# Altium schematic sheet PSU.SchDoc
size B
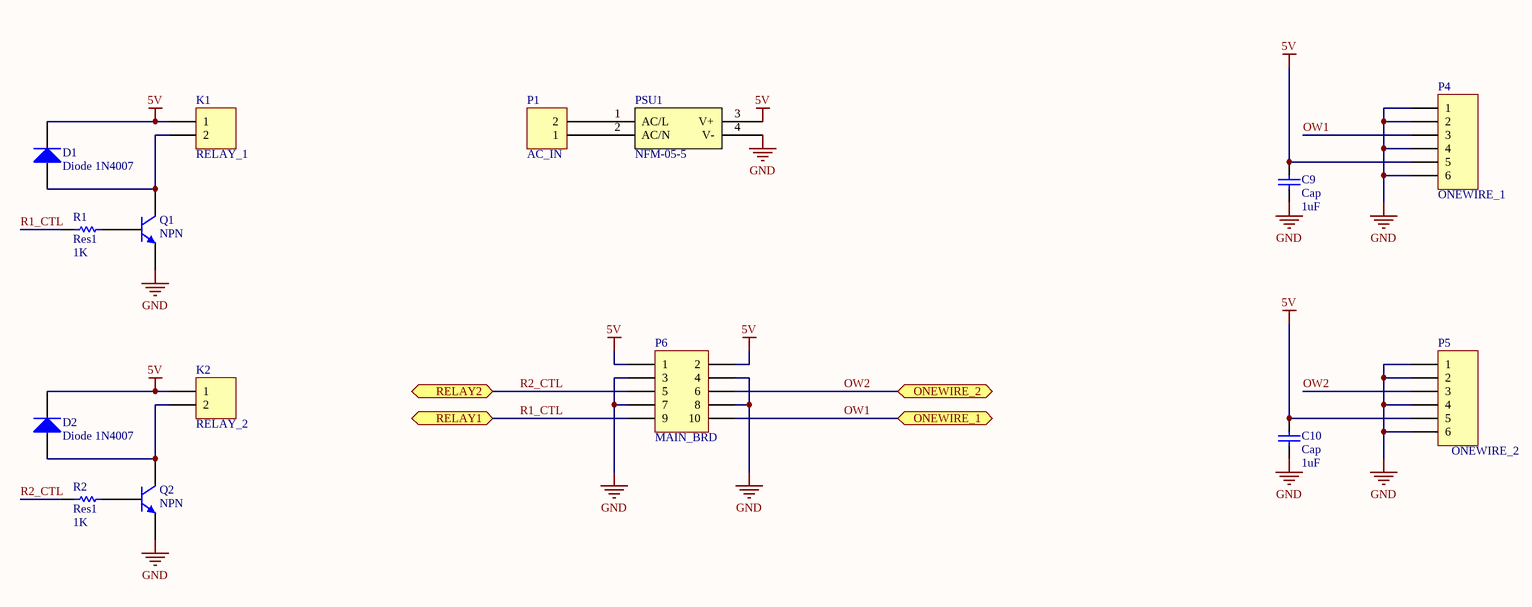
[diagram p0: PSU.SchDoc]

## Parts
C9  Cap  value 1uF  [RAD-0.2]
C10  Cap  value 1uF  [RAD-0.2]
D1  Diode 1N4007  [DO-41]
D2  Diode 1N4007  [DO-41]
K1  RELAY_1  [ALE12XXX]
K2  RELAY_2  [ALE12XXX]
P1  AC_IN  [2POS 0.312" HEADER]
P4  ONEWIRE_1  [CONN MOD JACK R/A 6P6C]
P5  ONEWIRE_2  [CONN MOD JACK R/A 6P6C]
P6  MAIN_BRD  [HDR2X5]
PSU1  NFM-05-5  [NFM-05-5]
Q1  NPN  [TO-92 BENT LEAD]
Q2  NPN  [TO-92 BENT LEAD]
R1  Res1  value 1K  [AXIAL-0.3]
R2  Res1  value 1K  [AXIAL-0.3]

## Ports
ONEWIRE_1, ONEWIRE_2, RELAY1, RELAY2

## Nets
5V: C9.2 C10.2 D1.2(K) D2.2(K) K1.1 K2.1 P4.5 P5.5 P6.1 P6.2 PSU1.3(V+)
GND: C9.1 C10.1 P4.1 P4.2 P4.4 P4.6 P5.1 P5.2 P5.4 P5.6 P6.3 P6.4 P6.7 P6.8 PSU1.4(V-) Q1.3(E) Q2.3(E)
OW1: P4.3 P6.10 ; port ONEWIRE_1
OW2: P5.3 P6.6 ; port ONEWIRE_2
R1_CTL: P6.9 R1.1 ; port RELAY1
R2_CTL: P6.5 R2.1 ; port RELAY2
NetD1_1: D1.1(A) K1.2 Q1.1(C)
NetD2_1: D2.1(A) K2.2 Q2.1(C)
NetP1_1: P1.1 PSU1.2(AC/N)
NetP1_2: P1.2 PSU1.1(AC/L)
NetQ1_2: Q1.2(B) R1.2
NetQ2_2: Q2.2(B) R2.2

## Library data of the parts
C9 C10 = Cap: Capacitor; Supplier 1: Digi-Key; Supplier Part Number 1: 445-8607-ND
D1 D2 = Diode 1N4007: 1 Amp General Purpose Rectifier; Supplier Part Number 1: 1N4007DICT-ND; Supplier 1: Digi-Key
K1 K2 P1 = Header 2: Header, 2-Pin; Supplier 1: Digi-Key
  K1 K2: Supplier Part Number 1: 255-1365-ND
  P1: Supplier Part Number 1: A106608-ND
P4 P5 = Header 6: Header, 6-Pin; Supplier Part Number 1: A105007CT-ND; Supplier 1: Digi-Key
P6 = Header 5X2: Header, 5-Pin, Dual row; Supplier Part Number 1: ED1543-ND; Supplier 1: Digi-Key
PSU1 = NFM-05-5: 5V 5W AC/DC Power Supply; Supplier Part Number 1: NFM-05-5; Supplier 1: Aulux
Q1 Q2 = NPN: NPN Bipolar Transistor; Supplier 1: Digi-Key; Supplier Part Number 1: BC547BBU-ND
R1 R2 = Res1: Resistor; Supplier 1: Digi-Key; Supplier Part Number 1: CF14JT1K00CT-ND